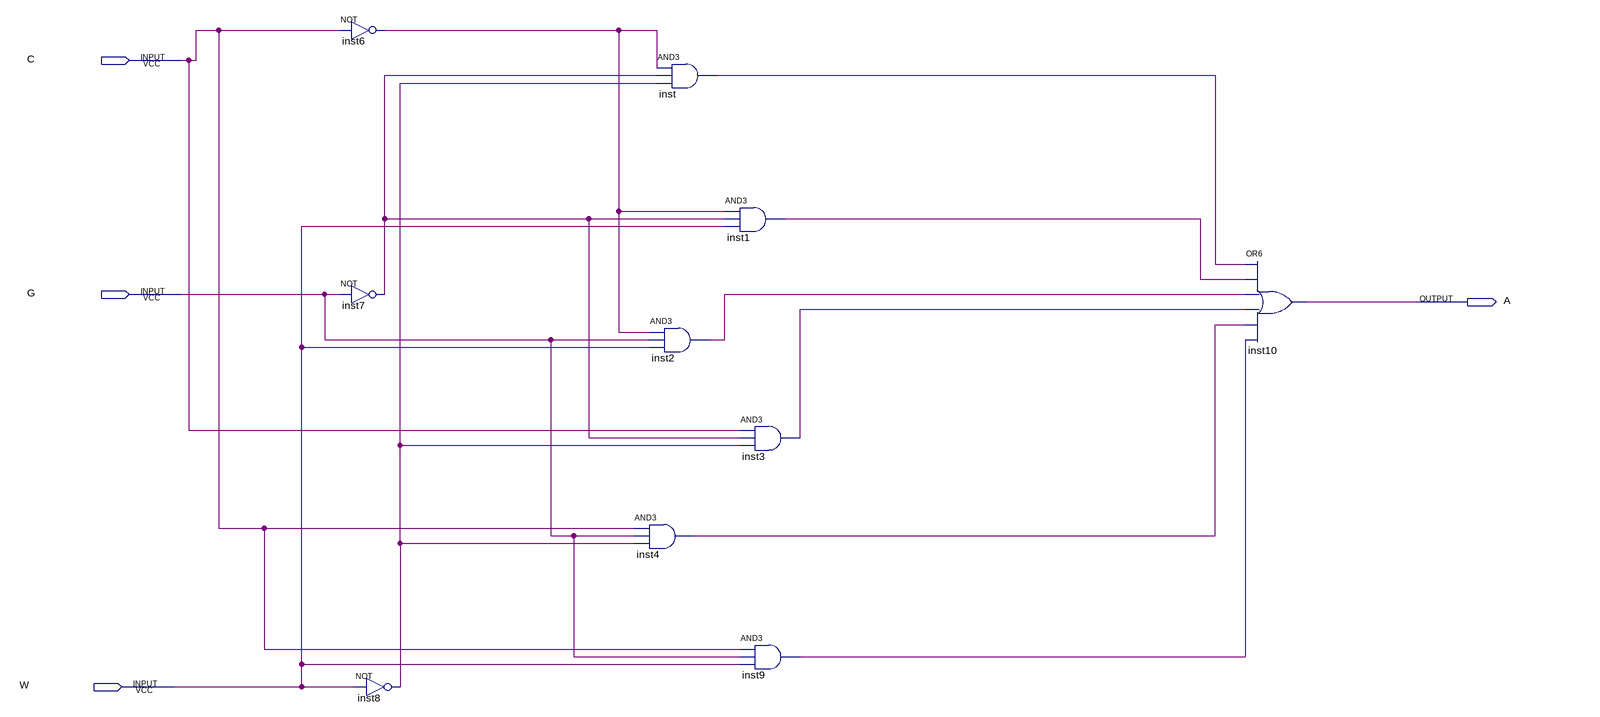
[diagram p0: schematic sheet]
// Quartus schematic Lab2Step2.bdf as structural Verilog: 10 symbols, 4 pins
module Lab2Step2 (
  input  C,
  input  G,
  input  W,
  output A
);

  wire inst1_out, inst2_out, inst3_out, inst4_out, inst6_out, inst7_out, inst8_out, inst9_out, inst_out;

  not inst6 (inst6_out, C);
  not inst7 (inst7_out, G);
  not inst8 (inst8_out, W);
  and inst (inst_out, inst6_out, inst7_out, inst8_out);
  and inst2 (inst2_out, inst6_out, G, W);
  and inst4 (inst4_out, C, G, inst8_out);
  and inst1 (inst1_out, inst6_out, inst7_out, W);
  and inst3 (inst3_out, C, inst7_out, inst8_out);
  and inst9 (inst9_out, C, G, W);
  or inst10 (A, inst_out, inst1_out, inst2_out, inst3_out, inst4_out, inst9_out);
endmodule
